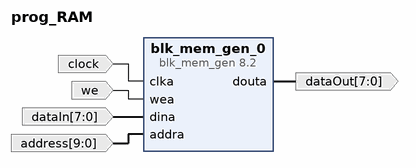
[diagram p0: block diagram of the top level]
# Vivado block design prog_RAM, Vivado 2015.2
create_bd_design prog_RAM

create_bd_port -dir I clock
create_bd_port -dir I we
create_bd_port -dir O -from 7 -to 0 dataOut
create_bd_port -dir I -from 7 -to 0 dataIn
create_bd_port -dir I -from 9 -to 0 address

create_bd_cell -type ip -vlnv xilinx.com:ip:blk_mem_gen:8.2 blk_mem_gen_0
set_property -dict [list \
  CONFIG.Memory_Type Single_Port_RAM \
  CONFIG.Enable_32bit_Address false \
  CONFIG.Use_Byte_Write_Enable false \
  CONFIG.Write_Width_A 8 \
  CONFIG.Write_Depth_A 1024 \
  CONFIG.Read_Width_A 8 \
  CONFIG.Operating_Mode_A NO_CHANGE \
  CONFIG.Enable_A Always_Enabled \
  CONFIG.Register_PortA_Output_of_Memory_Primitives false \
  CONFIG.Fill_Remaining_Memory_Locations true \
  CONFIG.Remaining_Memory_Locations 0 \
  CONFIG.Use_RSTA_Pin false \
  CONFIG.Port_B_Clock 0 \
  CONFIG.Port_B_Write_Rate 0 \
  CONFIG.Port_B_Enable_Rate 0 \
  CONFIG.use_bram_block Stand_Alone \
] [get_bd_cells blk_mem_gen_0]

# ---- connections ----

connect_bd_net [get_bd_ports clock] [get_bd_pins blk_mem_gen_0/clka]
connect_bd_net [get_bd_ports we] [get_bd_pins blk_mem_gen_0/wea]
connect_bd_net [get_bd_pins blk_mem_gen_0/douta] [get_bd_ports dataOut]
connect_bd_net [get_bd_ports dataIn] [get_bd_pins blk_mem_gen_0/dina]
connect_bd_net [get_bd_ports address] [get_bd_pins blk_mem_gen_0/addra]

validate_bd_design
save_bd_design
